# Altium schematic sheet MATRIX_SCH.SchDoc
size A4
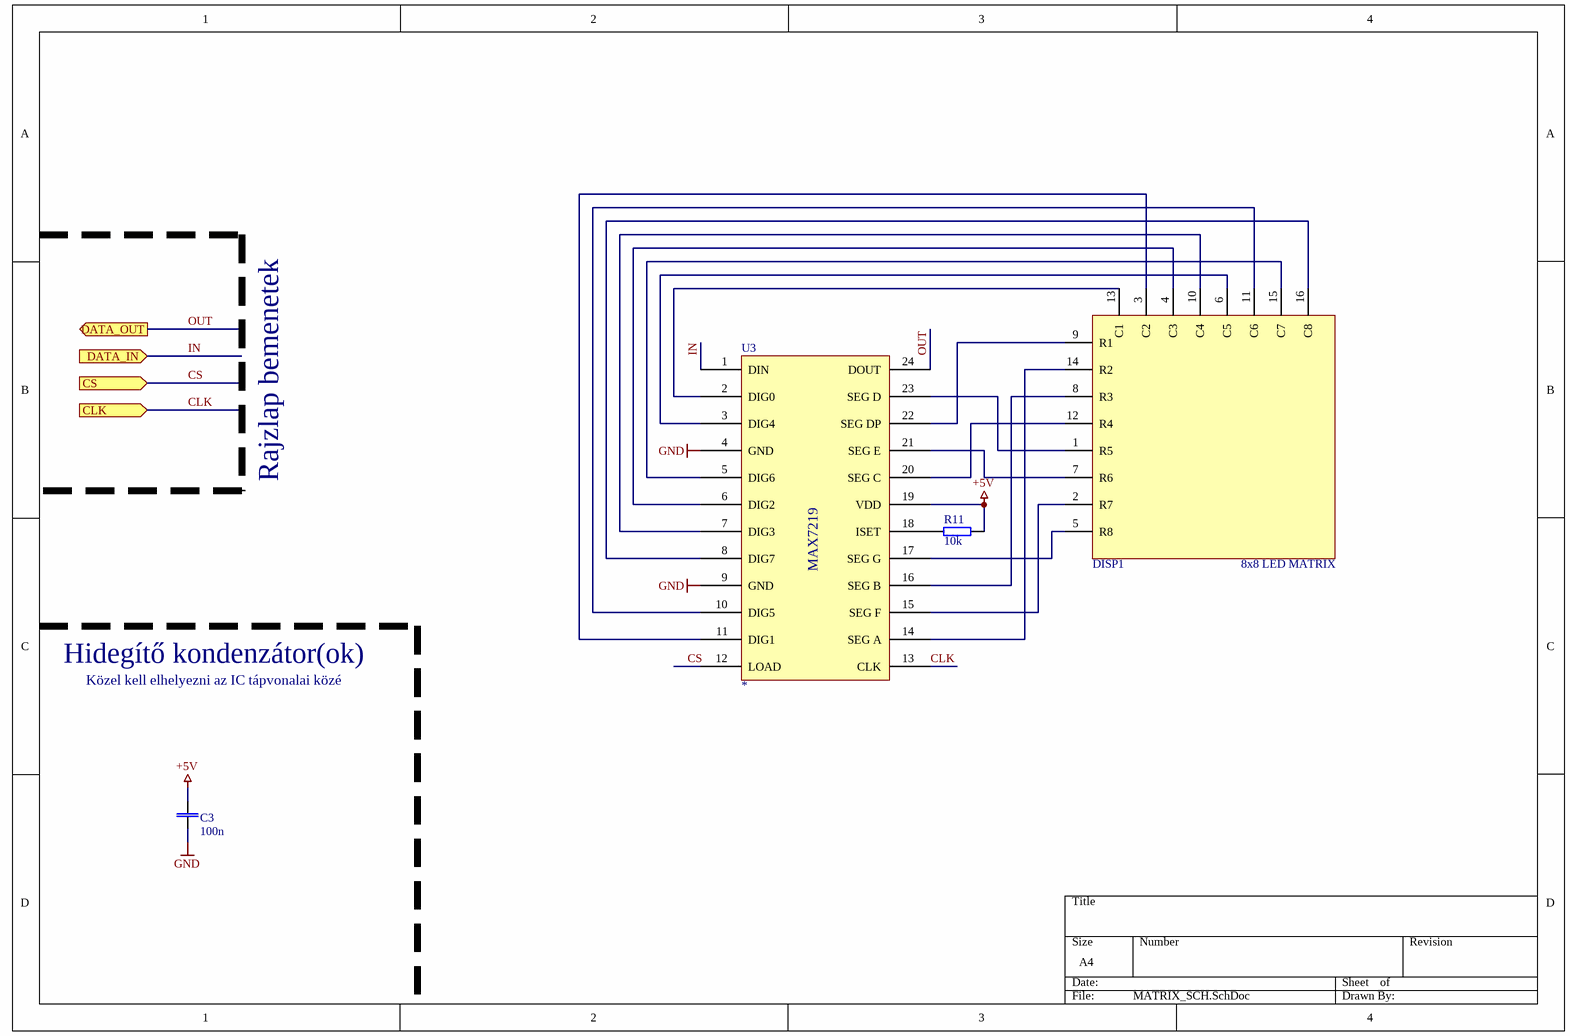
[diagram p0: MATRIX_SCH.SchDoc]

## Parts
C3  100n  [CAP 0805]
DISP1  8x8 LED MATRIX  [8x8_32mm_LED_MATRIX]
R11  10k  [RES 0805]
U3  *  [SO24]

## Ports
CLK (in), CS (in), DATA_IN (in), DATA_OUT (out)

## Nets
+5V: C3.2 R11.2 U3.19(VDD)
GND: C3.1 U3.4(GND) U3.9(GND)
CLK: U3.13(CLK) ; port CLK
CS: U3.12(LOAD) ; port CS
IN: U3.1(DIN) ; port DATA_IN
OUT: U3.24(DOUT) ; port DATA_OUT
NetDISP1_1: DISP1.1(R5) U3.23(SEG_D)
NetDISP1_2: DISP1.2(R7) U3.15(SEG_F)
NetDISP1_3: DISP1.3(C2) U3.11(DIG1)
NetDISP1_4: DISP1.4(C3) U3.6(DIG2)
NetDISP1_5: DISP1.5(R8) U3.17(SEG_G)
NetDISP1_6: DISP1.6(C5) U3.3(DIG4)
NetDISP1_7: DISP1.7(R6) U3.21(SEG_E)
NetDISP1_8: DISP1.8(R3) U3.16(SEG_B)
NetDISP1_9: DISP1.9(R1) U3.22(SEG_DP)
NetDISP1_10: DISP1.10(C4) U3.7(DIG3)
NetDISP1_11: DISP1.11(C6) U3.10(DIG5)
NetDISP1_12: DISP1.12(R4) U3.20(SEG_C)
NetDISP1_13: DISP1.13(C1) U3.2(DIG0)
NetDISP1_14: DISP1.14(R2) U3.14(SEG_A)
NetDISP1_15: DISP1.15(C7) U3.5(DIG6)
NetDISP1_16: DISP1.16(C8) U3.8(DIG7)
NetR11_1: R11.1 U3.18(ISET)

## Notes on the sheet
- Rajzlap bemenetek
- Hidegítő kondenzátor(ok)
- Közel kell elhelyezni az IC tápvonalai közé

## Library data of the parts
C3 = CAP: NON POLARIZED CAPACITOR; VALUE: 100n; Reference: 82-10-76; Supplier: Lomex
DISP1 = 8x8_LED_MATRIX: 8x8 LED Matrix display; Supplier: *; Reference: *; VALUE: 8x8 LED MATRIX
R11 = RES: RESISTOR; Reference: 81-10-99; Supplier: Lomex; VALUE: 10k
U3 = MAX7219: 8X8 LED DRIVER IC; Reference: *; Supplier: *; VALUE: *